# EAGLE schematic PointAssistant (EAGLE 6.1)
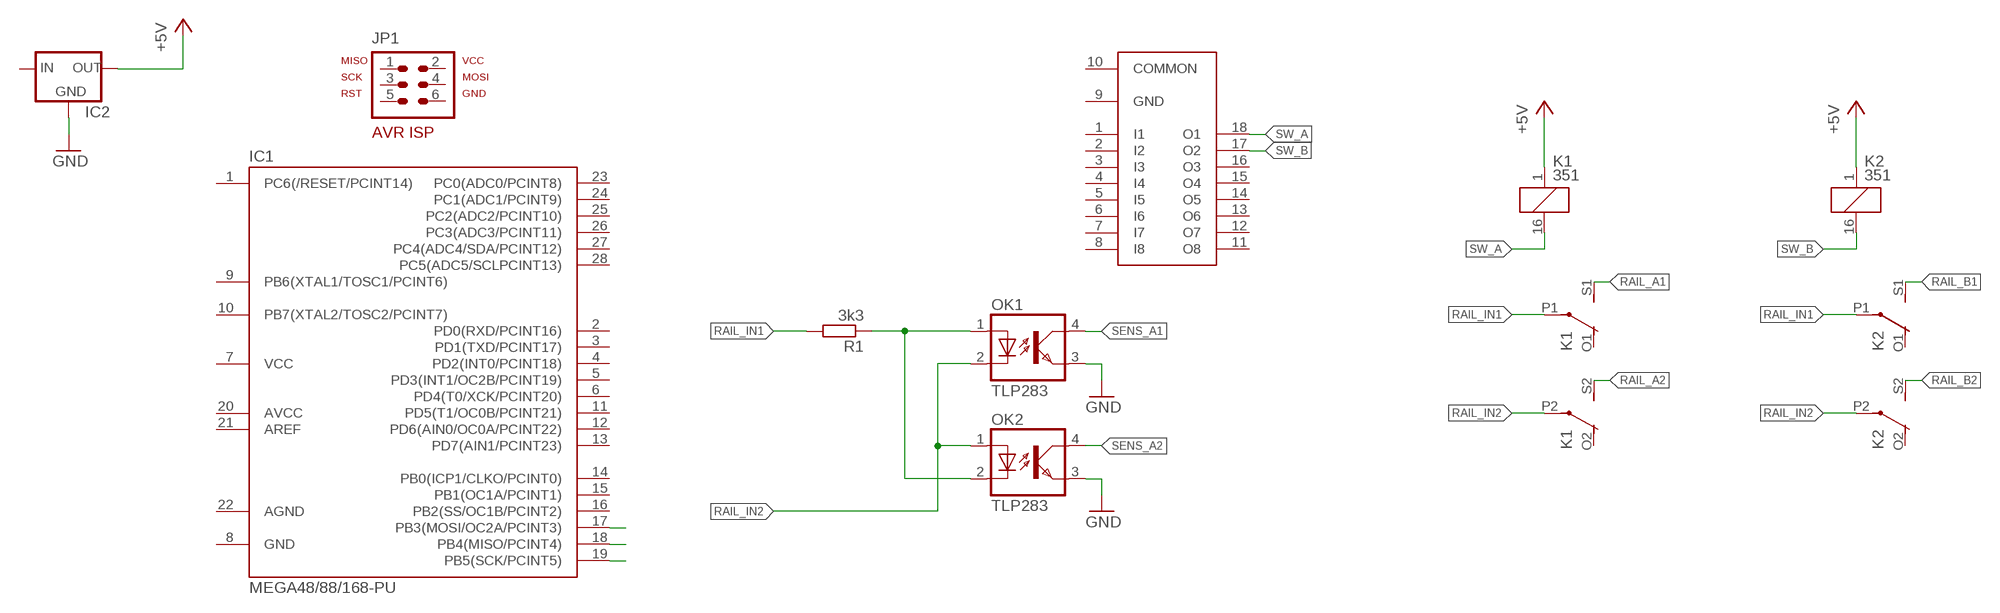
[diagram p0: schematic, sheet 1]

## Parts
IC1  MEGA48/88/168-PU  [DIL28-3]
IC2  78MXXS  [78MXXS]
JP1  AVR-ISP-6VERT  [AVR-ISP-6]
K1  351  [351]
K2  351  [351]
OK1  TLP283  [MINI-FLAT-4]
OK2  TLP283  [MINI-FLAT-4]
R1  3k3  R-EU_R0603  [R0603]
U$1  TD62083AP  [DIL18]

## Nets
+5V: IC2.OUT K1.1 K2.1
GND: IC2.GND OK1.3(EMIT) OK2.3(EMIT)
N$1: OK1.1(A) OK2.2(C) R1.1
N$6: IC1.19(PB5(SCK/PCINT5))
N$7: IC1.18(PB4(MISO/PCINT4))
N$8: IC1.17(PB3(MOSI/OC2A/PCINT3))
RAIL_A1: K1.S1(2:S)
RAIL_A2: K1.S2(3:S)
RAIL_B1: K2.S1(2:S)
RAIL_B2: K2.S2(3:S)
RAIL_IN1: K1.P1(2:P) K2.P1(2:P) R1.2
RAIL_IN2: K1.P2(3:P) K2.P2(3:P) OK1.2(C) OK2.1(A)
SENS_A1: OK1.4(COL)
SENS_A2: OK2.4(COL)
SW_A: K1.16 U$1.18(O1)
SW_B: K2.16 U$1.17(O2)
Unconnected: IC1.1(PC6(/RESET/PCINT14)) IC1.2(PD0(RXD/PCINT16)) IC1.3(PD1(TXD/PCINT17)) IC1.4(PD2(INT0/PCINT18)) IC1.5(PD3(INT1/OC2B/PCINT19)) IC1.6(PD4(T0/XCK/PCINT20)) IC1.9(PB6(XTAL1/TOSC1/PCINT6)) IC1.10(PB7(XTAL2/TOSC2/PCINT7)) IC1.11(PD5(T1/OC0B/PCINT21)) IC1.12(PD6(AIN0/OC0A/PCINT22)) IC1.13(PD7(AIN1/PCINT23)) IC1.14(PB0(ICP1/CLKO/PCINT0)) IC1.15(PB1(OC1A/PCINT1)) IC1.16(PB2(SS/OC1B/PCINT2)) IC1.20(AVCC) IC1.21(AREF) IC1.23(PC0(ADC0/PCINT8)) IC1.24(PC1(ADC1/PCINT9)) IC1.25(PC2(ADC2/PCINT10)) IC1.26(PC3(ADC3/PCINT11)) IC1.27(PC4(ADC4/SDA/PCINT12)) IC1.28(PC5(ADC5/SCLPCINT13)) IC2.IN JP1.1 JP1.2 JP1.3 JP1.4 JP1.5 JP1.6 K1.O1(2:O) K1.O2(3:O) K2.O1(2:O) K2.O2(3:O) U$1.1(I1) U$1.2(I2) U$1.3(I3) U$1.4(I4) U$1.5(I5) U$1.6(I6) U$1.7(I7) U$1.8(I8) U$1.9(GND) U$1.10(COMMON) U$1.11(O8) U$1.12(O7) U$1.13(O6) U$1.14(O5) U$1.15(O4) U$1.16(O3)

## Power pins joined to a net without a drawn wire
AGND: IC1.22(AGND)
GND: IC1.8(GND)
VCC: IC1.7(VCC)

## Library data of the parts
IC1 = avr-4:MEGA48/88/168-PU
IC2 = v-reg:78MXXS: VOLTAGE REGULATOR
JP1 = avr-7:AVR-ISP-6: AVR ISP-6 Serial Programming Header
K1 K2 = relay:351: RELAY 2 x switch, Omron; OC_FARNELL: unknown; OC_NEWARK: unknown
OK1 OK2 = optocoupler:TLP283: TOSHIBA PHOTOCOUPLER GaAs IRED & PHOTO-TRANSISTOR Source: http://www.semicon.toshiba.co.jp/td/en/Opto/Photocoupler/en_20050928_TLP283_datasheet.pdf; OC_FARNELL: unknown; OC_NEWARK: unknown
R1 = rcl:R-EU_: RESISTOR, European symbol
U$1 = myparts:TD62083AP